# EAGLE design Adafruit 1.27 128x96 RGB OLED (EAGLE 6.3)
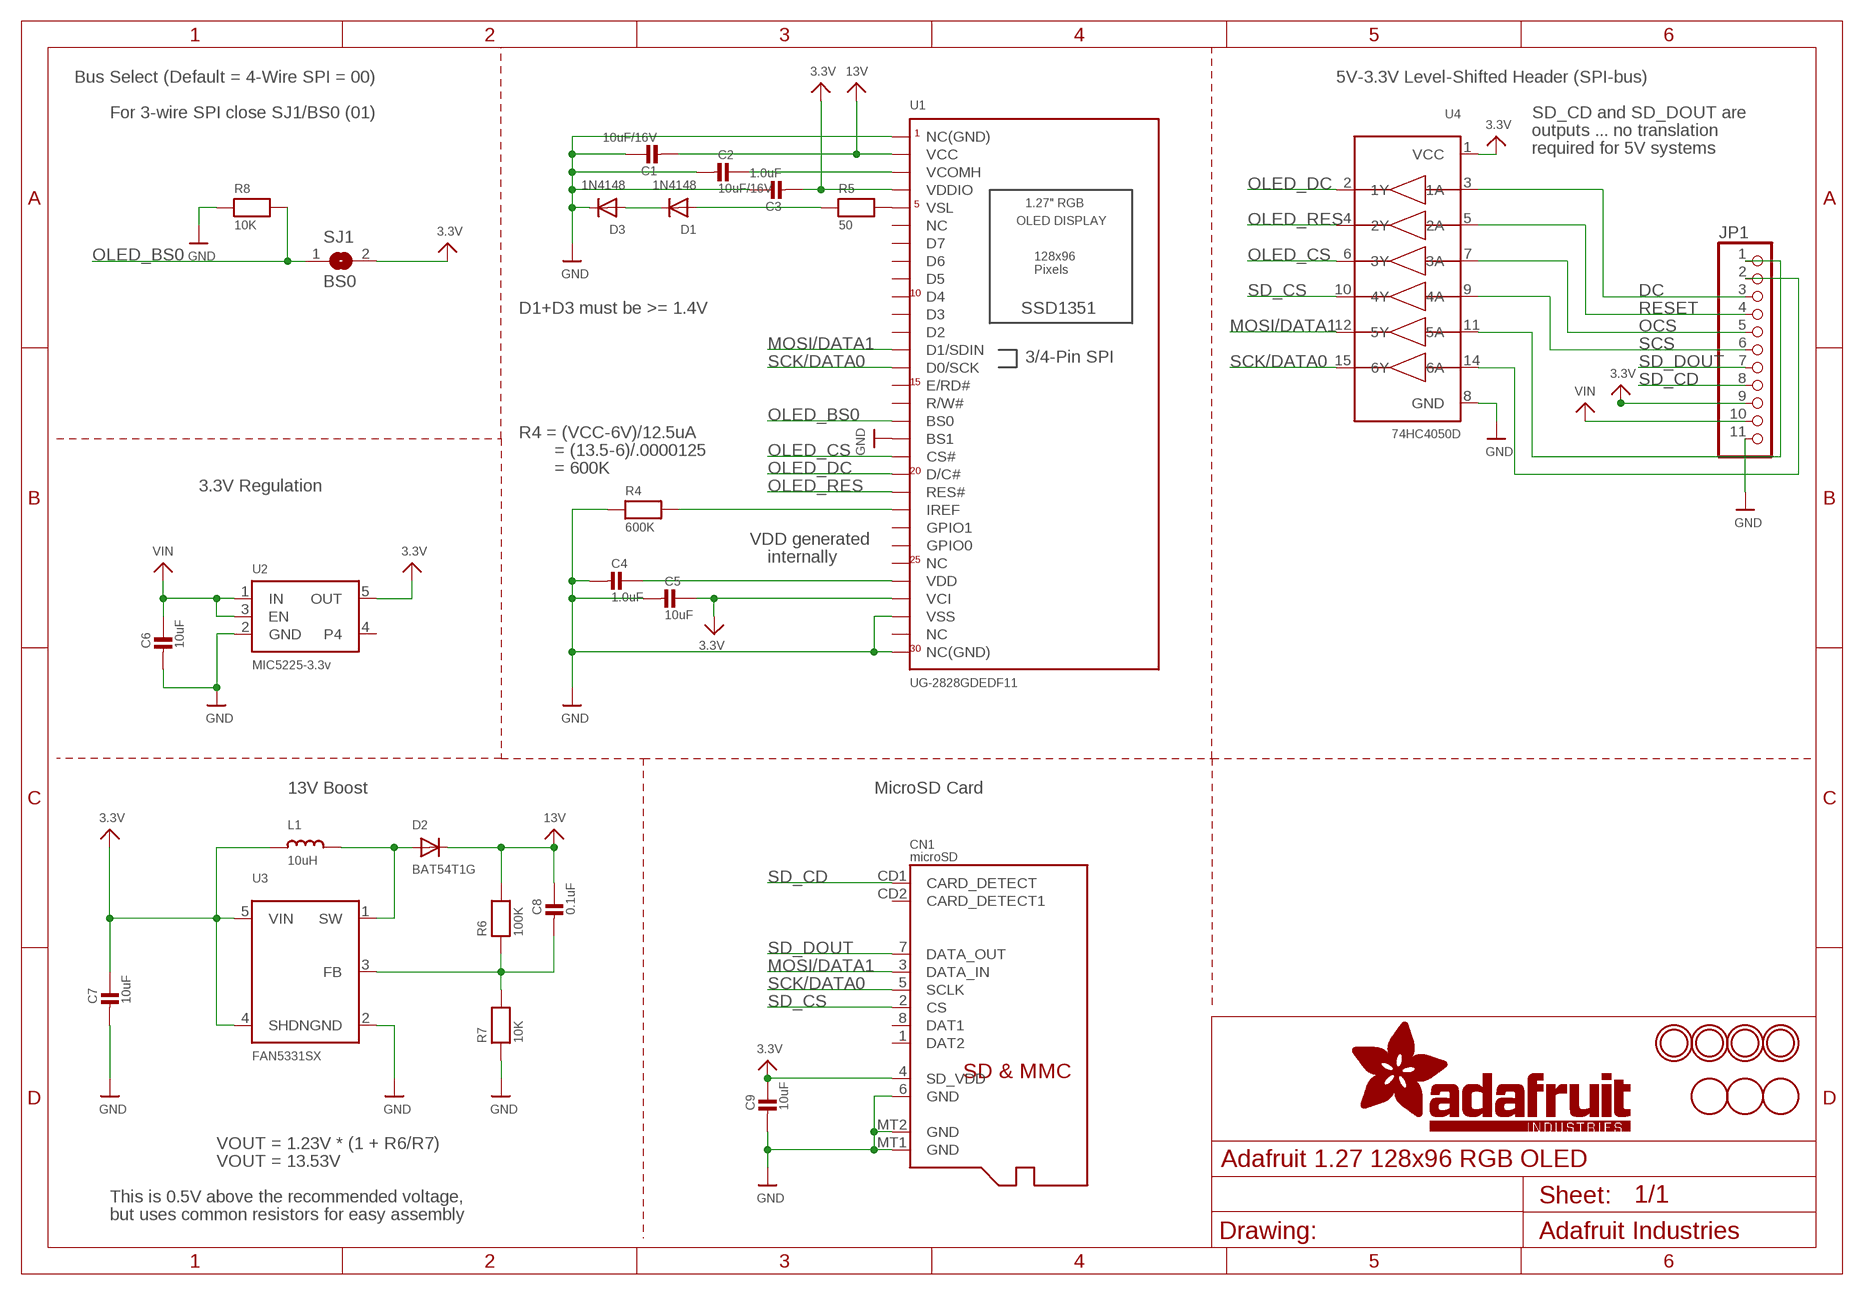
[diagram p0: schematic, sheet 1]

## Parts
C1  10uF/16V  CAP_CERAMIC_0805MP  [_0805MP]
C2  10uF/16V  CAP_CERAMIC_0805MP  [_0805MP]
C3  1.0uF  CAP_CERAMIC_0805MP  [_0805MP]
C4  1.0uF  CAP_CERAMIC_0805MP  [_0805MP]
C5  10uF  CAP_CERAMIC_0805MP  [_0805MP]
C6  10uF  CAP_CERAMIC_0805MP  [_0805MP]
C7  10uF  CAP_CERAMIC_0805MP  [_0805MP]
C8  0.1uF  CAP_CERAMIC_0805MP  [_0805MP]
C9  10uF  CAP_CERAMIC_0805MP  [_0805MP]
CN1  microSD  MICROSD  [MICROSD]
D1  1N4148  DIODESOD-323  [SOD-323]
D2  BAT54T1G  DIODESOD-123  [SOD-123]
D3  1N4148  DIODESOD-323  [SOD-323]
JP1  HEADER-1X11  [1X11_ROUND]
L1  10uH  INDUCTOR  [INDUCTOR_1007]
R4  600K  RESISTOR_0805MP  [_0805MP]
R5  50  RESISTOR_0805MP  [_0805MP]
R6  100K  RESISTOR_0805MP  [_0805MP]
R7  10K  RESISTOR_0805MP  [_0805MP]
R8  10K  RESISTOR_0805MP  [_0805MP]
SJ1  BS0  SOLDERJUMPERREFLOW_NOPASTE  [SOLDERJUMPER_REFLOW_NOPASTE]
U1  UG-2828GDEDF11  DISP_OLED_UG-2896GDEAF11TOP  [FPC_XF2M-3015-1A]
U2  MIC5225-3.3v  VREG_SOT23-5  [SOT23-5]
U3  FAN5331SX  FAN5331  [SOT23-5@1]
U4  74HC4050D  [SOIC16]
U$22  MOUNTINGHOLE2.5  [MOUNTINGHOLE_2.5_PLATED]
U$23  MOUNTINGHOLE2.5  [MOUNTINGHOLE_2.5_PLATED]
U$24  MOUNTINGHOLE2.5  [MOUNTINGHOLE_2.5_PLATED]
U$25  MOUNTINGHOLE2.5  [MOUNTINGHOLE_2.5_PLATED]
U$26  FIDUCIAL  [FIDUCIAL_1MM]
U$27  FIDUCIAL  [FIDUCIAL_1MM]
U$29  FIDUCIAL  [FIDUCIAL_1MM]

## Nets
3.3V: C3.2 C5.1 C7.1 C9.1 CN1.4(SD_VDD) JP1.9 L1.P$1 SJ1.2 U1.P$4(VCI) U1.P$27(VDDIO) U2.5(OUT) U3.4(SHDN) U3.5(VIN) U4.1(VCC)
13V: C1.2 C8.1 D2.C R6.2 U1.P$29(VCC)
DC: JP1.3 U4.3(1A)
GND: C1.1 C2.2 C3.1 C4.2 C5.2 C6.2 C7.2 C9.2 CN1.6(GND) CN1.MT1(GND) CN1.MT2(GND) D3.C JP1.11 R4.1 R7.1 R8.1 U1.P$1(NC(GND)) U1.P$3(VSS) U1.P$13(BS1) U1.P$30(NC(GND)) U2.2(GND) U3.2(GND) U4.8(GND)
IREF: R4.2 U1.P$9(IREF)
MOSI/DATA1: CN1.3(DATA_IN) U1.P$18(D1/SDIN) U4.12(5Y)
N$3: C4.1 U1.P$5(VDD)
N$5: D2.A L1.P$2 U3.1(SW)
N$6: R5.2 U1.P$26(VSL)
N$7: D1.A R5.1
N$8: C8.2 R6.1 R7.2 U3.3(FB)
N$11: D1.C D3.A
N$12: JP1.1 U4.11(5A)
N$13: JP1.2 U4.14(6A)
OCS: JP1.5 U4.7(3A)
OLED_BS0: R8.2 SJ1.1 U1.P$14(BS0)
OLED_CS: U1.P$12(CS#) U4.6(3Y)
OLED_DC: U1.P$11(D/C#) U4.2(1Y)
OLED_RES: U1.P$10(RES#) U4.4(2Y)
RESET: JP1.4 U4.5(2A)
SCK/DATA0: CN1.5(SCLK) U1.P$17(D0/SCK) U4.15(6Y)
SCS: JP1.6 U4.9(4A)
SD_CD: CN1.CD1(CARD_DETECT) JP1.8
SD_CS: CN1.2(CS) U4.10(4Y)
SD_DOUT: CN1.7(DATA_OUT) JP1.7
VCOMH: C2.1 U1.P$28(VCOMH)
VIN: C6.1 JP1.10 U2.1(IN) U2.3(EN)
Unconnected: CN1.1(DAT2) CN1.8(DAT1) CN1.CD2(CARD_DETECT1) U1.P$2(NC) U1.P$6(NC) U1.P$7(GPIO0) U1.P$8(GPIO1) U1.P$15(R/W#) U1.P$16(E/RD#) U1.P$19(D2) U1.P$20(D3) U1.P$21(D4) U1.P$22(D5) U1.P$23(D6) U1.P$24(D7) U1.P$25(NC) U2.4

## Notes on the sheet
- Bus Select (Default = 4-Wire SPI = 00) | 5V-3.3V Level-Shifted Header (SPI-bus)
- For 3-wire SPI close SJ1/BS0 (01) | SD_CD and SD_DOUT are
- outputs ... no translation
- required for 5V systems
- D1+D3 must be >= 1.4V
- R4 = (VCC-6V)/12.5uA
- = (13.5-6)/.0000125
- = 600K
- 3.3V Regulation
- VDD generated
- internally
- 13V Boost | MicroSD Card
- VOUT = 1.23V * (1 + R6/R7)
- VOUT = 13.53V
- This is 0.5V above the recommended voltage,
- but uses common resistors for easy assembly

## Library data of the parts
C1-C9 = microbuilder:CAP_CERAMIC: Ceramic Capacitors For new designs, use the packages preceded by an '_' character since they are more reliable: The following footprints should be used on most boards: _0402 - Standard footprint for regular board layouts _0603 - Standard footprint for regular board layouts _0805 - Standard footprint for regular board layouts For extremely tight-pitch boards where space is at a premium, the following 'micro-pitch' footprints can be used (smaller pads, no silkscreen outline, etc.): _0402MP - Micro-pitch footprint for very dense/compact boards _0603MP - Micro-pitch footprint for very dense/compact boards _0805MP - Micro-pitch footprint for very dense/compact boards Commonly Stocked Parts 0402 - 0402 Surface Mount Capacitors 16pF 50V 5% [Digikey: 445-4899-2-ND] 18pF 50V 5% [Digikey: 490-1281-2-ND] 22pF 50V 5% [Digikey: 490-1283-2-ND] 68pF 50V 5% [Digikey: 490-1289-2-ND] 0.1uF 10V 10% [Digikey: 490-1318-2-ND] 1.0uF 6.3V 10% [Digikey: 490-1320-2-ND] 0603 - 0603 Surface Mount Capacitors 16 pF 50V 5% [Digikey: 445-5051-2-ND] 22 pF 50V [Digikey: PCC220ACVTR-ND] 33 pF 50V 5% [Digikey: 490-1415-1-ND] 56pF 50V 5% [Digikey: 490-1421-1-ND] 220pF 50V 5% [Digikey: 445-1285-1-ND] 680 pF 50V 2200 pF 50V 5% C0G [Digikey: 445-1297-1-ND] 5600 pF 100V 5% X7R [Digikey: 478-3711-1-ND] 0.1 µF 25V 10% [Digikey: PCC2277TR-ND] 0.22 µF 16V 10% X7R [Digikey: 445-1318-1-ND] 1.0 µF 25V 10% [Digikey: 445-5146-2-ND] 0603 - RF Specific 3pF 250V +/-0.1pF RF [Digikey: 712-1347-1-ND] 18 pF 250V 5% [Digikey: 478-3505-1-ND or 712-1322-1-ND] 56 pF 250V 5% C0G RF [Digikey: 490-4867-1-ND] 68 pF 250V RF [Digikey: 490-4868-1-ND] 0805 - 0805 Surface Mount Capacitors 220 pF 250V 2% RF Ceramic Capacitor [Digikey: 712-1398-1-ND] 1000 pF 50V 2% NP0 Ceramic Capacitor [Digikey: 478-3760-1-ND] 0.1 µF 25V 10% Ceramic Capacitor [Digikey: PCC1828TR-ND] 1.0 µF 16V 10% Ceramic Capacitor[Digikey: 490-1691-2-ND] 10.0 µF 10V 10% Ceramic Capacitor[Digikey: 709-1228-1-ND] 10.0 uF 16V 10% Ceramic Capacitor [Digikey: 478-5165-2-ND] 47 uF 6.3V 20% Ceramic Capacitor [Digikey: 587-1779-1-ND or 399-5506-1-ND] 1206 - 1206 Surface Mount Capacitors 47uF 10V 20% Ceramic Capacitor [Digikey: 490-5528-1-ND or 399-5508-1-ND or 445-6010-1-ND] 100uF 6.3V -20%, +80% Y5V Ceramic Capacitor (Digikey: 490-4512-1-ND, Mouser: 81-GRM31CF50J107ZE1L)
CN1 = microbuilder:MICROSD: MicroSD/Transflash Card Holder with SPI pinout 3M: 2908-05WB-MG 4UConnector: 19656 Footprint courtesy: Adafruit Industries
D1-D3 = microbuilder:DIODE: Diode SMA Model Volts Amps Type Vf Vr Digikey # Notes SSA34-E3 40V 3A Schottky 480mV @ 3A 200uA @ 40V SSA34-E3/61TGITR-ND CDBA120-G 20V 1A Schottky 500mV @ 1A 500uA @ 20V 641-1014-6-ND REEL MBRA210 10V 2A Schottky 350mV @ 2A 700uA @ 10V MBRA210LT3 SOD-123 Model Volts Amps Type Vf Vr Order # Notes BAT54T1G 30V 200mA Schottky 800mV @ 200mA 2uA @ 25V BAT54T1GOSTR-ND B0530W 30V 500mA Schottky 430mV @ 500mA 130uA @ 30V B0530W-FDICT-ND REEL MBR120 20V 1A Schottky 340mV @ 1A MBR120VLSFT1GOSCT-ND SOD-323 Model Volts Amps Type Vf Vr Order # Notes PMEG2005EJ 20V 500mA Schottky 355mV @ 500mA 568-4110-1-ND ZLLS410 10V 570mA Schottky 380mV @ 570mA ZLLS410CT-ND 1N4148WS 75V 150mA Silicon/Simple 1V 1N4148WSFSCT-ND REEL SOD-523 Model Volts Amps Type Vf Vr Order # Notes BAT54XV2 30V 200mA Schottky 0.8V @ 100mA BAT54XV2CT-ND TB751S 30V 30mA Schottky RB751S-40TE61CT-ND SOT23-R/W (R = Solder Paste/Reflow Ovens, W = Hand-Soldering) Model Volts Amps Type Vf Vr Order # Notes BAT54FILM 40V 300mA Schottky 497-7162-1-ND
JP1 = microbuilder:HEADER-1X11
L1 = microbuilder:INDUCTOR: Inductors 0603: 10nH Ceramic Inductor - microwire antenna/RF (Digikey: 712-1434-2-ND) 0805: 560nH Ceramic Inductor - RF (Digikey: 553-1047-1-ND) 270nH Ceramic Inductor - Q = 40@250MHz, +-5%, 1 Ohm DC Resistance (Digikey: 535-10506-2-ND) 1007 (2518 Metric) SMT: 10µH 10% 250mOhm 820mA 1007 Inductor (Digikey: 587-2189-1-ND) 22µH 10% 500mOhm 580mA 1007 Inductor (Digikey: 587-2190-1-ND) 47µH 10% 950mOhm 420mA 1007 Inductor (Digikey: 587-2191-1-ND) 47µH 5% 100mOhm 1A 1008 Inductor (Digikey: 732-1816-1-ND) 5.0x5.0mm (Taiyo Yuden NR5040 Series) 6.8µH 20% 2.3A 64mOhm Inductor (Digikey: 587-2374-2-ND) 5.0x5.0mm (TDK VLC5045 Series) 4.7µH 20% 3.3A 34mOhm Inductor (Digikey: 445-6526-1-ND) 6.8µH 20% 2.7A 46mOhm Inductor (Digikey: 445-6527-1-ND) 6.0x6.0mm (TDK VLC6045 Series) 4.7µH 20% 3.8A 27mOhm Inductor (Digikey: 445-6538-2-ND) 6.8µH 20% 3A 41mOhm Inductor (Digikey: 445-6540-1-ND) 6.2µH 30% 2.2A 45mOhm Inductor (Digikey: SRR5028-6R2YCT-ND) - Not TDK VLC6045 but footprint should match 6.0x6.0mm (TDK SLF6045 Series) 6.8uH 30% 2A 33mOhm Inductor (Digikey: 445-4572-1-ND, Mouser: 810-SLF645T6R8N2R0PF) 6.0x6.0mm (Sumida CDRH5D28 Series) 6.2uH 30% 1.8A 45mOhm Inductor (Digikey: 308-1542-1-ND) Taiyo Yuden NR3015T2R2M - 2.2uH 20% 1.5A (Digikey: 587-1648-2-ND, Mouser: 963-NR3015T2R2M) - Used with TI TPS62172 CoilCraft RFID Transponder Coil - MA5532-AE (For use with AS3935 Lightning Sensor)
R4-R8 = microbuilder:RESISTOR: Resistors For new designs, use the packages preceded by an '_' character since they are more reliable: The following footprints should be used on most boards: _0402 - Standard footprint for regular board layouts _0603 - Standard footprint for regular board layouts _0805 - Standard footprint for regular board layouts For extremely tight-pitch boards where space is at a premium, the following 'micro-pitch' footprints can be used (smaller pads, no silkscreen outline, etc.): _0402MP - Micro-pitch footprint for very dense/compact boards _0603MP - Micro-pitch footprint for very dense/compact boards _0805MP - Micro-pitch footprint for very dense/compact boards
SJ1 = microbuilder:SOLDERJUMPER: SMD Solder JUMPER Solder the two pads together to create a connection, or remove the solder to break it. REFLOW - Use this footprint for solder paste and reflow ovens. WAVE - Use this footprint for hand-soldering (larger pads). CLOSED - Has a trace between the two pads to ensure it is closed by default. The trace needs to be cut to disable the jumper, and can be closed again by creating a solder bridge between the two pads.
U1 = microbuilder:DISP_OLED_UG-2896GDEAF11: 128x96 1.27" RGB OLED - UG-2896GDEAF11 30-Pin 0.5mm Pitch FPC Cable (Top+Bottom Contacts) - OMRON XF2M-3015-1A (Digikey: OR723TR-ND) This FPC connector has contacts on the top and bottom, but the appropriate pin needs to be selected depending on whether the OLED will be inserted right-side up (use the TOP pinout) or upside-down (use the BOTTOM pinout).
U2 = microbuilder:VREG_SOT23-5: SOT23-5 Fixed Voltage Regulators Part Current Out V Out V In V Dropout θJA (°C/W) TJ (°C) Digikey Part No. ADP121 150mA 3.3V 3.4-5.5V 0.09V @ 150mA -- -- ADP121-AUJZ33R7CT-ND ADP121 150mA 3.0V 3.1-5.5V 0.09V @ 150mA -- -- ADP121-AUJZ30R7CT-ND ADP122 300mA 3.3V 3.4-5.5V 0.085V @ 300mA -- -- ADP122AUJZ-3.3-R7CT-ND ADP1712 300mA 3.3V 3.5-5.5V 0.17V @ 300mA -- -- ADP1712AUJZ-3.3-R7TR-ND AP7311 (Low Cost) 150mA 3.3V 3.5-6V 0.15V @ 150mA -- -- AP7311-33WG-7DICT-ND LD39015M18R 150mA 1.8V 1.9V-5.5V 0.08V @ 100mA -- -- 497-6977-1-ND LP2985A-33DBVR 150mA 3.3V 3.3-16V 0.28V @ 150mA 206 150 296-18479-1-ND MCP1824T-3302E/OT 300mA 3.3V 3.5V-6V 0.2V @ 300mA -- -- MCP1824T-3302E/OTCT-ND MIC5205-2.5YM5 TR 150mA 2.5V 2.7-16V 0.165V @ 150mA -- -- 576-1257-2-ND MIC5205-3.0YM5 TR 150mA 3.0V 3.2V-16V 0.165V @ 150mA -- -- 576-1258-2-ND MIC5205-3.3YM5 TR 150mA 3.3V 3.5V-16V 0.165V @ 150mA -- -- 576-1259-2-ND TPS780330220 150mA 3.3V+2.2V 3.6-5.5V 250mV Max -- -- 296-23332-1-ND TDA3663/N1,135 100mA 3.3V 3.5-45V 0.18V @ 50mA -- -- 568-5343-1-ND Max operating temp can be calculated using θJA, TJ (max junction temperature), and power in watts. Set the "Maximum Ambient Temperature" until it reaches TJ ("Max Junction Temperature"), which is the absolute limit for safe use of the regulator: Heat Sink Temperature Calculator <http://www.daycounter.com/Calculators/Heat-Sink-Temperature-Calculator.phtml> For example, With 12V source into a 3.3V LP2985 and a 30mA load, we are dissipating (12V-3.3V) * 0.03A = 0.261W. With a θJA of 206 °C/W, a TJ of 150°C, and 261mW we can safely use the chip without a heat sink up to 75°C (=147.1°C Junction Temperature).
U3 = microbuilder:FAN5331: FAN5331 - LED/OLED 20V Boost Converter Digikey: FAN5331SXCT-ND
U4 = microbuilder:74HC4050D: 6-channel level shifter 74HC4050D - 2V-6V Supply SOIC16 Digikey: 74HC4050D,653-ND Mouser: 771-74HC4050D-T TSSOP16 Digikey: 296-9215-1-ND Mouser:
U$22-U$25 = microbuilder:MOUNTINGHOLE: Mounting Hole For #2 screws (0.086"/2.18mm width, 0.094"/2.4mm hole) use 2.5mm; BOM: EXCLUDE
U$26 U$27 U$29 = adafruit:FIDUCIAL: For use by pick and place machines to calibrate the vision/machine, 1mm By microbuilder.eu

## Board
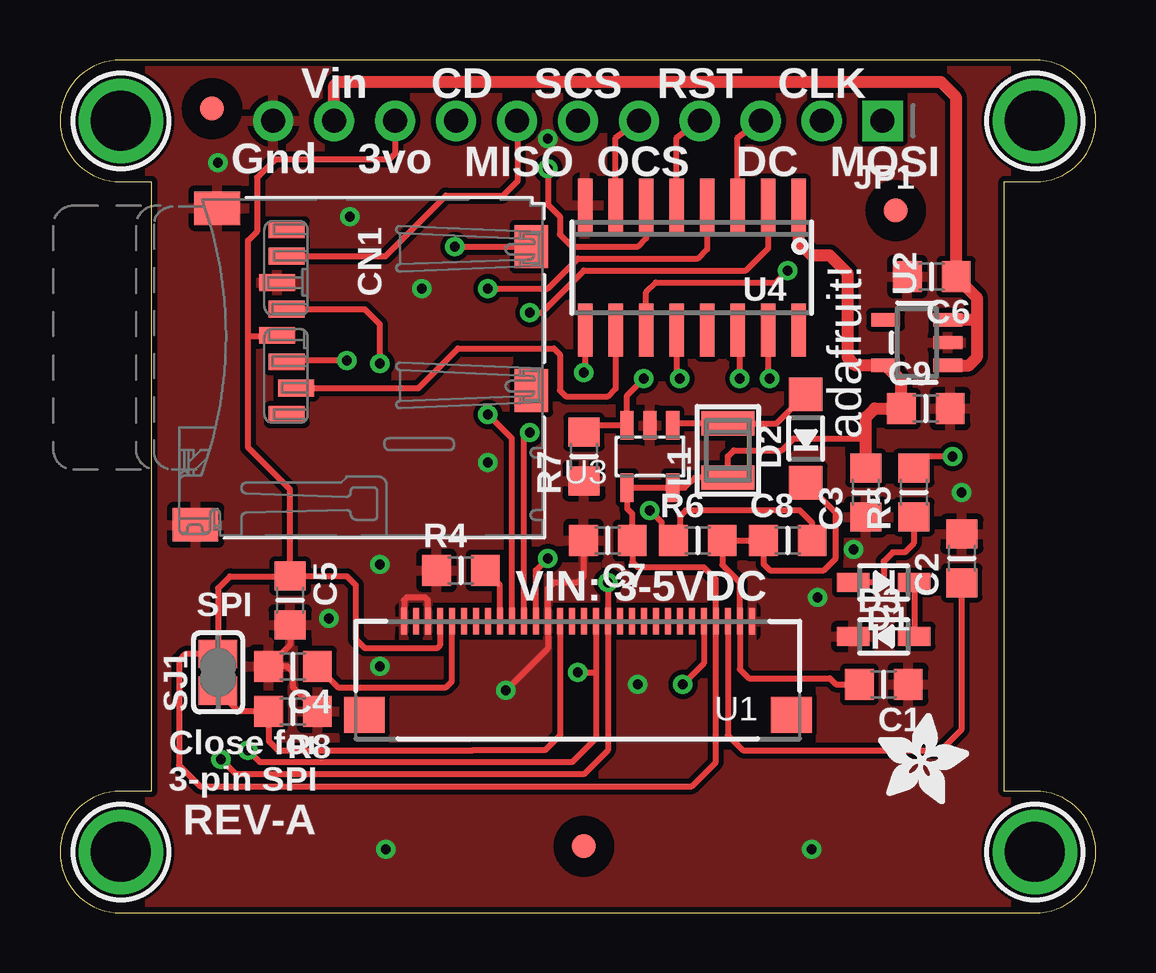
[diagram p1: board, top side]
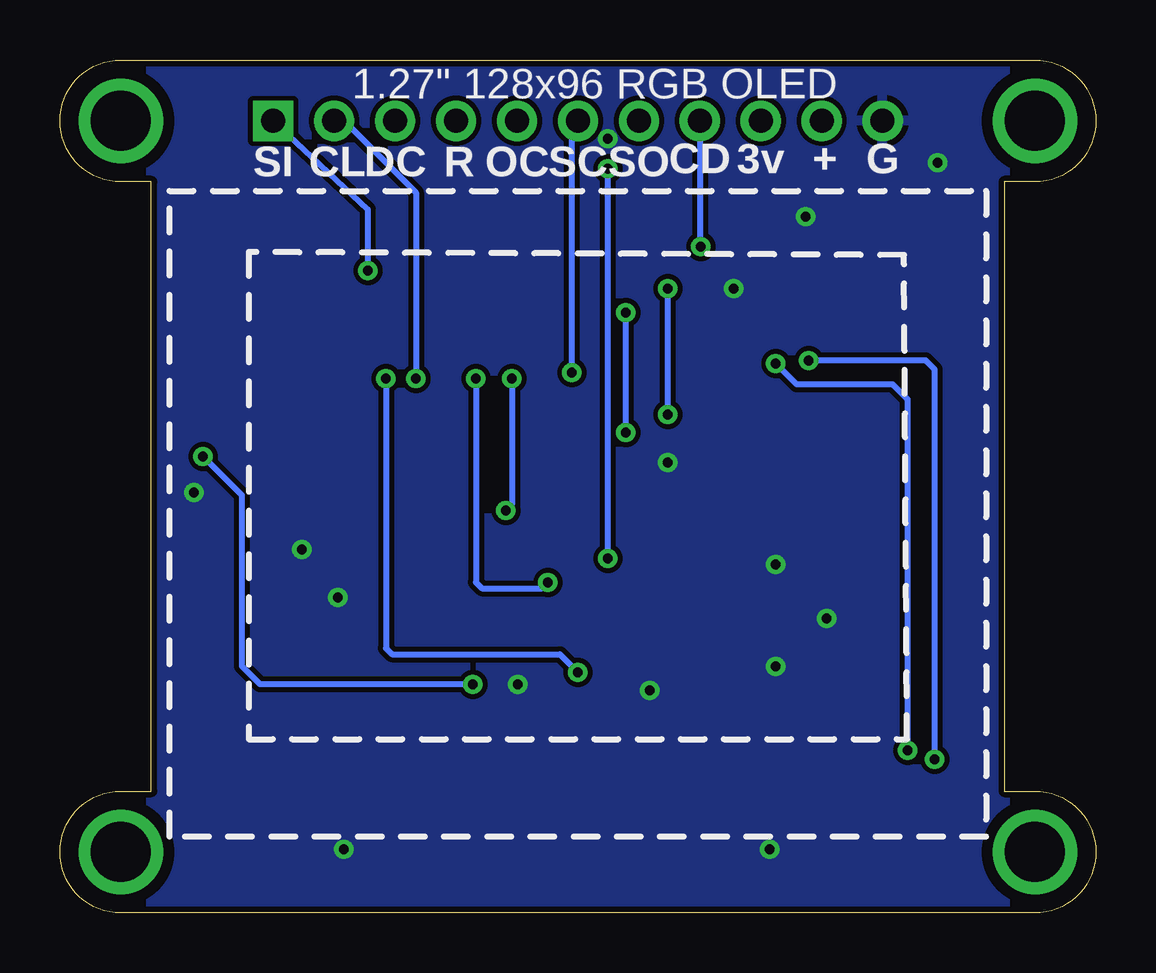
[diagram p2: board, bottom side, seen from below]

Size 43.18 x 35.56 mm. Coordinates in mm from the lower left corner, seen from the top.
Outline: 3.81,5.08 2.54,5.08 arc90 0,2.54 arc90 2.54,0 40.64,0 arc90 43.18,2.54 arc90 40.64,5.08 39.37,5.08 39.37,30.48 40.64,30.48 arc90 43.18,33.02 arc90 40.64,35.56 2.54,35.56 arc90 0,33.02 arc90 2.54,30.48 3.81,30.48 3.81,5.08
Copper layers (1*16): Top 0.035mm / dielectric 1.5mm / Bottom 0.035mm
Design rules "adafruit": minimum track width 8mil, minimum drill 15.5mil, track to track 8mil, track to pad 8mil, pad to pad 8mil, via to via 8mil, smd to smd 8mil, copper to edge 10mil, drill to drill 8mil, minimum pad ring 10mil, minimum via ring 8mil, stop-mask expansion 4mil, vias tented up to drill 20mil, thermal gap 10mil

### Footprints (pad centres in the part's own frame; a part is rotated, then mirrored left to right if it is on the bottom)
_0805MP = smd 1.2 x 1.3: 1 -1.016,0; 2 1.016,0
MICROSD = smd 0.7 x 1.5: 1 9,-10.64; 2 7.9,-10.24; 3 6.8,-10.64; 4 5.7,-11.04; 5 4.6,-10.64; 6 3.5,-11.04; 7 2.4,-10.64; 8 1.3,-10.64 | smd 1.8 x 1.4: CD1 2,-0.44; CD2 8,-0.44 | smd 1.4 x 1.9: MT1 0.4,-13.54; MT2 13.6,-14.44
SOD-323 = smd 1.35 x 0.8: A 1.27,0; C -1.27,0
SOD-123 = smd 1.4 x 1.4: A 1.85,0; C -1.85,0
1X11_ROUND = drill 1 pad 1.676 square: 1 -12.7,0 | drill 1 pad 1.676: 2 -10.16,0; 3 -7.62,0; 4 -5.08,0; 5 -2.54,0; 6 0,0; 7 2.54,0; 8 5.08,0; 9 7.62,0; 10 10.16,0; 11 12.7,0
INDUCTOR_1007 = smd 1.016 x 2.2: P$1 -1.127,0; P$2 1.127,0
SOLDERJUMPER_REFLOW_NOPASTE = smd 1.168 x 1.6: 1 -0.762,0; 2 0.762,0
FPC_XF2M-3015-1A = smd 0.25 x 1.1: P$1 7.25,-2.63; P$2 6.75,-2.63; P$3 6.25,-2.63; P$4 5.75,-2.63; P$5 5.25,-2.63; P$6 4.75,-2.63; P$7 4.25,-2.63; P$8 3.75,-2.63; P$9 3.25,-2.63; P$10 2.75,-2.63; P$11 2.25,-2.63; P$12 1.75,-2.63; P$13 1.25,-2.63; P$14 0.75,-2.63; P$15 0.25,-2.63; P$16 -0.25,-2.63; P$17 -0.75,-2.63; P$18 -1.25,-2.63; P$19 -1.75,-2.63; P$20 -2.25,-2.63; P$21 -2.75,-2.63; P$22 -3.25,-2.63; P$23 -3.75,-2.63; P$24 -4.25,-2.63; P$25 -4.75,-2.63; P$26 -5.25,-2.63; P$27 -5.75,-2.63; P$28 -6.25,-2.63; P$29 -6.75,-2.63; P$30 -7.25,-2.63 | smd 1.7 x 1.5: SUPPORT1 8.9,1.27; SUPPORT2 -8.9,1.27
SOT23-5 = smd 0.55 x 1.2: 1 -0.95,-1.3; 2 0,-1.3; 3 0.95,-1.3; 4 0.95,1.3; 5 -0.95,1.3
SOT23-5@1 = smd 0.55 x 1.2: 1 -0.95,-1.3; 2 0,-1.3; 3 0.95,-1.3; 4 0.95,1.3; 5 -0.95,1.3
SOIC16 = smd 0.6 x 2.2: 1 -4.445,-2.6; 2 -3.175,-2.6; 3 -1.905,-2.6; 4 -0.635,-2.6; 5 0.635,-2.6; 6 1.905,-2.6; 7 3.175,-2.6; 8 4.445,-2.6; 9 4.445,2.6; 10 3.175,2.6; 11 1.905,2.6; 12 0.635,2.6; 13 -0.635,2.6; 14 -1.905,2.6; 15 -3.175,2.6; 16 -4.445,2.6
MOUNTINGHOLE_2.5_PLATED = drill 2.5 pad 3.2: P$1 0,0
FIDUCIAL_1MM = smd 1 x 1: 1 0,0

### Placement (x,y rotation side)
C1  34.34,9.53 180 top
C2  37.59,14.78 90 top
C3  33.59,17.53 90 top
C4  9.71,10.28 180 top
C5  9.59,13.03 270 top
C6  36.34,26.53 180 top
C7  22.84,15.53 180 top
C8  30.34,15.53 0 top
C9  36.09,21.03 0 top
CN1  20.09,29.78 270 top
D1  34.34,13.78 180 top
D2  31.09,19.78 90 top
D3  34.34,11.53 0 top
JP1  21.59,33.02 180 top
L1  27.84,19.28 90 top
R4  16.71,14.28 0 top
R5  35.59,17.53 90 top
R6  26.59,15.53 0 top
R7  21.84,19.03 90 top
R8  9.71,8.41 180 top
SJ1  6.59,10.03 90 top
U1  21.59,9.53 180 top
U2  35.72,23.78 90 top
U3  24.59,19.03 180 top
U4  26.34,26.9 180 top
U$22  2.54,2.54 0 top
U$23  40.64,2.54 0 top
U$24  40.64,33.02 0 top
U$25  2.54,33.02 0 top
U$26  21.84,2.78 0 top
U$27  34.84,29.28 0 top
U$28  [ADAFRUIT_3.5MM]  34.09,4.53 0 top
U$29  6.34,33.53 0 top

### Tracks (layer width: path | path; a pad name or v marks a point on that pad's centre or on a via)
3.3V
  Top 0.25: C5.1 9.57,14.03 7.09,14.03 6.59,13.53 SJ1.2 5.23,10.79 4.96,10.53 4.96,6.16 5.84,5.28 26.34,5.28 27.34,6.28 U1.P$27 27.34,13.91 26.84,14.41 24.09,14.41 23.86,14.64 C7.1 23.86,16.64 23.64,16.86 U3.4 U3.5 26.04,17.73 26.46,18.15 L1.P$1 27.84,19.03 28.09,19.28 30.09,19.28 30.59,19.78 33.59,19.78 | U1.P$4 15.84,11.16 15.71,11.03 12.71,11.03 12.34,11.41 12.34,13.66 11.96,14.03 9.61,14.03 C5.1 | C5.1 9.59,17.66 7.84,19.41 7.84,24.03 | CN1.4 9,24.03 7.84,24.03 | JP1.9 13.97,31.66 13.71,31.41 8.96,31.41 8.21,30.66 8.21,28.41 7.84,28.03 7.84,24.03
  Top 0.5: C3.2 33.59,19.78 33.59,20.66 33.97,21.03 C9.1 35.07,22.17 U2.5 33.16,22.83 32.84,23.16 32.84,26.66 32.09,27.41 31.34,27.41 30.79,27.96 U4.1
13V
  Top 0.25: C1.2 32.34,9.53 32.09,9.78 28.71,9.78 28.34,10.16 U1.P$29 28.34,13.78 27.71,14.41 27.61,14.51 R6.2 C8.1 29.32,14.55 29.59,14.28 31.84,14.28 32.34,14.78 32.34,16.68 D2.C
DC
  Top 0.25: U4.3 28.25,32.31 JP1.3
GND  (via drill 0.4)
  Top 0.25: C5.2 9.59,11.17 C4.2 9.46,10.28 9.71,10.03 9.71,9.41 10.71,8.41 R8.1 | v18.59,9.28 20.34,11.03 U1.P$13 20.34,13.53 20.59,13.78 21.59,13.78 21.84,14.03 21.84,15.51 C7.2 | U1.P$3 15.34,13.03 15.21,13.16 14.46,13.16 14.34,13.03 U1.P$1
  other vias: 13.34,10.28 11.21,12.28 37.59,17.53 33.09,15.16 24.09,9.53 13.59,2.66 31.34,2.66 12.09,29.03 13.34,14.53 17.84,18.78 15.09,26.03 6.59,31.28 20.34,32.28 31.59,13.16
  pour Bottom (isolate 0.203): 43.23,36.36 -0.16,36.36 -0.41,-0.89 43.36,-0.51
  pour Top (isolate 0.203): 43.23,36.36 0.09,36.36 -0.28,-0.89 43.49,-0.51
IREF
  Top 0.25: U1.P$9 18.34,13.67 R4.2
MOSI/DATA1  (via drill 0.4)
  Top 0.25: v6.71,6.41 7.34,5.78 21.84,5.78 22.84,6.78 U1.P$18 v22.84,13.78 | v11.96,23.03 9.5,23.03 CN1.3 | U4.12 25.7,22.41 v25.84,22.28
  Bottom 0.25: v6.71,6.41 6.71,22.66 7.09,23.03 v11.96,23.03 | v25.84,22.28 25.84,13.78 25.59,13.53 23.09,13.53 v22.84,13.78
N$3
  Top 0.25: C4.1 10.73,10.26 11.59,9.41 16.09,9.41 16.34,9.66 U1.P$5
N$5
  Top 0.25: D2.A 29.87,20.41 L1.P$2 25.62,20.41 U3.1
N$6  (via drill 0.4)
  Top 0.25: U1.P$26 26.84,10.41 v25.96,9.53 | v37.22,19.03 36.07,19.03 R5.2
  Bottom 0.25: v25.96,9.53 34.84,9.53 35.59,10.28 35.59,17.41 v37.22,19.03
N$7
  Top 0.25: R5.1 35.59,15.41 35.22,15.03 34.72,15.03 34.34,14.66 34.34,14.03 34.09,13.78 D1.A
N$8  (via drill 0.4)
  Top 0.25: R7.2 22.12,20.33 U3.3 23.64,21.58 v24.34,22.28 | v24.59,16.78 25.09,16.28 25.09,15.53 R6.1 25.84,15.8 25.84,16.53 26.09,16.78 30.84,16.78 31.36,16.26 C8.2
  Bottom 0.25: v24.34,22.28 24.34,17.03 v24.59,16.78
N$11
  Top 0.25: D1.C D3.A
N$12  (via drill 0.4)
  Top 0.25: U4.11 24.43,25.88 24.84,26.28 29.84,26.28 v30.34,26.78
  Bottom 0.25: v30.34,26.78 30.34,29.33 JP1.1
N$13  (via drill 0.4)
  Top 0.25: v28.34,22.28 28.34,24.34 U4.14
  Bottom 0.25: JP1.2 31.59,33.28 28.34,30.03 v28.34,22.28
OCS
  Top 0.25: U4.7 23.16,32.31 JP1.5
OLED_BS0
  Top 0.25: SJ1.1 7.45,8.41 R8.2 8.7,7.17 9.09,6.78 17.21,6.78 20.21,6.78 20.84,7.41 U1.P$14
OLED_CS  (via drill 0.4)
  Top 0.25: U1.P$12 19.84,14.28 v20.34,14.78 | v20.34,31.03 20.34,29.53 20.84,29.03 20.84,28.28 21.34,27.78 24.09,27.78 24.43,28.12 U4.6
  Bottom 0.25: v20.34,14.78 v20.34,31.03
OLED_DC  (via drill 0.4)
  Top 0.25: U1.P$11 19.34,19.78 v19.59,20.03 | v19.59,25.03 20.09,25.03 21.84,26.78 28.59,26.78 29.52,27.71 U4.2
  Bottom 0.25: v19.59,20.03 v19.59,25.03
OLED_RES  (via drill 0.4)
  Top 0.25: U1.P$10 18.84,19.78 v17.84,20.78 | v17.84,26.03 20.34,26.03 21.59,27.28 26.59,27.28 26.98,27.66 U4.4
  Bottom 0.25: v17.84,20.78 v17.84,26.03
RESET
  Top 0.25: U4.5 25.7,32.31 JP1.4
SCK/DATA0  (via drill 0.4)
  Top 0.25: U1.P$17 22.34,10.03 | 22.34,10.03 22.34,7.28 21.34,6.28 8.34,6.28 v7.84,6.78 | v13.34,22.91 13.34,24.53 12.71,25.16 9.47,25.16 CN1.5 | U4.15 29.52,22.36 v29.59,22.28 | v21.59,10.03 22.34,10.03
  Bottom 0.25: v7.84,6.78 7.84,21.41 8.46,22.03 12.46,22.03 v13.34,22.91 | v29.59,22.28 29.59,11.03 29.34,10.78 22.34,10.78 v21.59,10.03
SCS  (via drill 0.4)
  Top 0.25: U4.9 21.89,22.59 v21.84,22.53
  Bottom 0.25: v21.84,22.53 21.84,33.03 JP1.6
SD_CD  (via drill 0.4)
  Top 0.25: v16.46,27.78 CN1.CD1
  Bottom 0.25: JP1.8 16.51,27.83 v16.46,27.78
SD_CS
  Top 0.25: CN1.2 14.94,21.88 16.59,23.53 20.59,23.53 20.84,23.28 20.84,21.78 21.09,21.53 22.84,21.53 23.16,21.86 U4.10
SD_DOUT
  Top 0.25: CN1.7 13.56,27.38 16.09,29.91 18.46,29.91 19.09,30.53 19.09,33.24 JP1.7
VCOMH
  Top 0.25: U1.P$28 27.84,7.41 28.46,6.78 36.72,6.78 37.59,7.66 C2.1
VIN
  Top 0.5: JP1.10 11.43,34.49 11.59,34.65 36.72,34.65 37.34,34.02 37.34,26.55 C6.1 37.36,26.51 38.22,25.66 38.22,24.78 | 38.22,24.78 38.22,23.16 37.89,22.83 U2.1 | U2.3 38.16,24.73 38.22,24.78

### Text on the board
tPlace: Vin | CD | SCS | RST | CLK | Gnd | 3vo | MISO | OCS | DC | MOSI | adafruit! | SPI | VIN: 3-5VDC | Close for / 3-pin SPI | REV-A
bPlace: 1.27" 128x96 RGB OLED | G | + | 3v | CD | SO | SC | OC | R | DC | CL | SI